# EasyEDA Pro project sjl.epro

# Schematic Schematic1
Board Name: Board1; Create Date: 2025-03-23; Page Name: P1; Project Name: 电赛_2025-03-23_10-41-51; Schematic Name: Schematic1; Update Date: 2025-04-03; Company: 嘉立创EDA; Page Size: A4; Version: V1.0
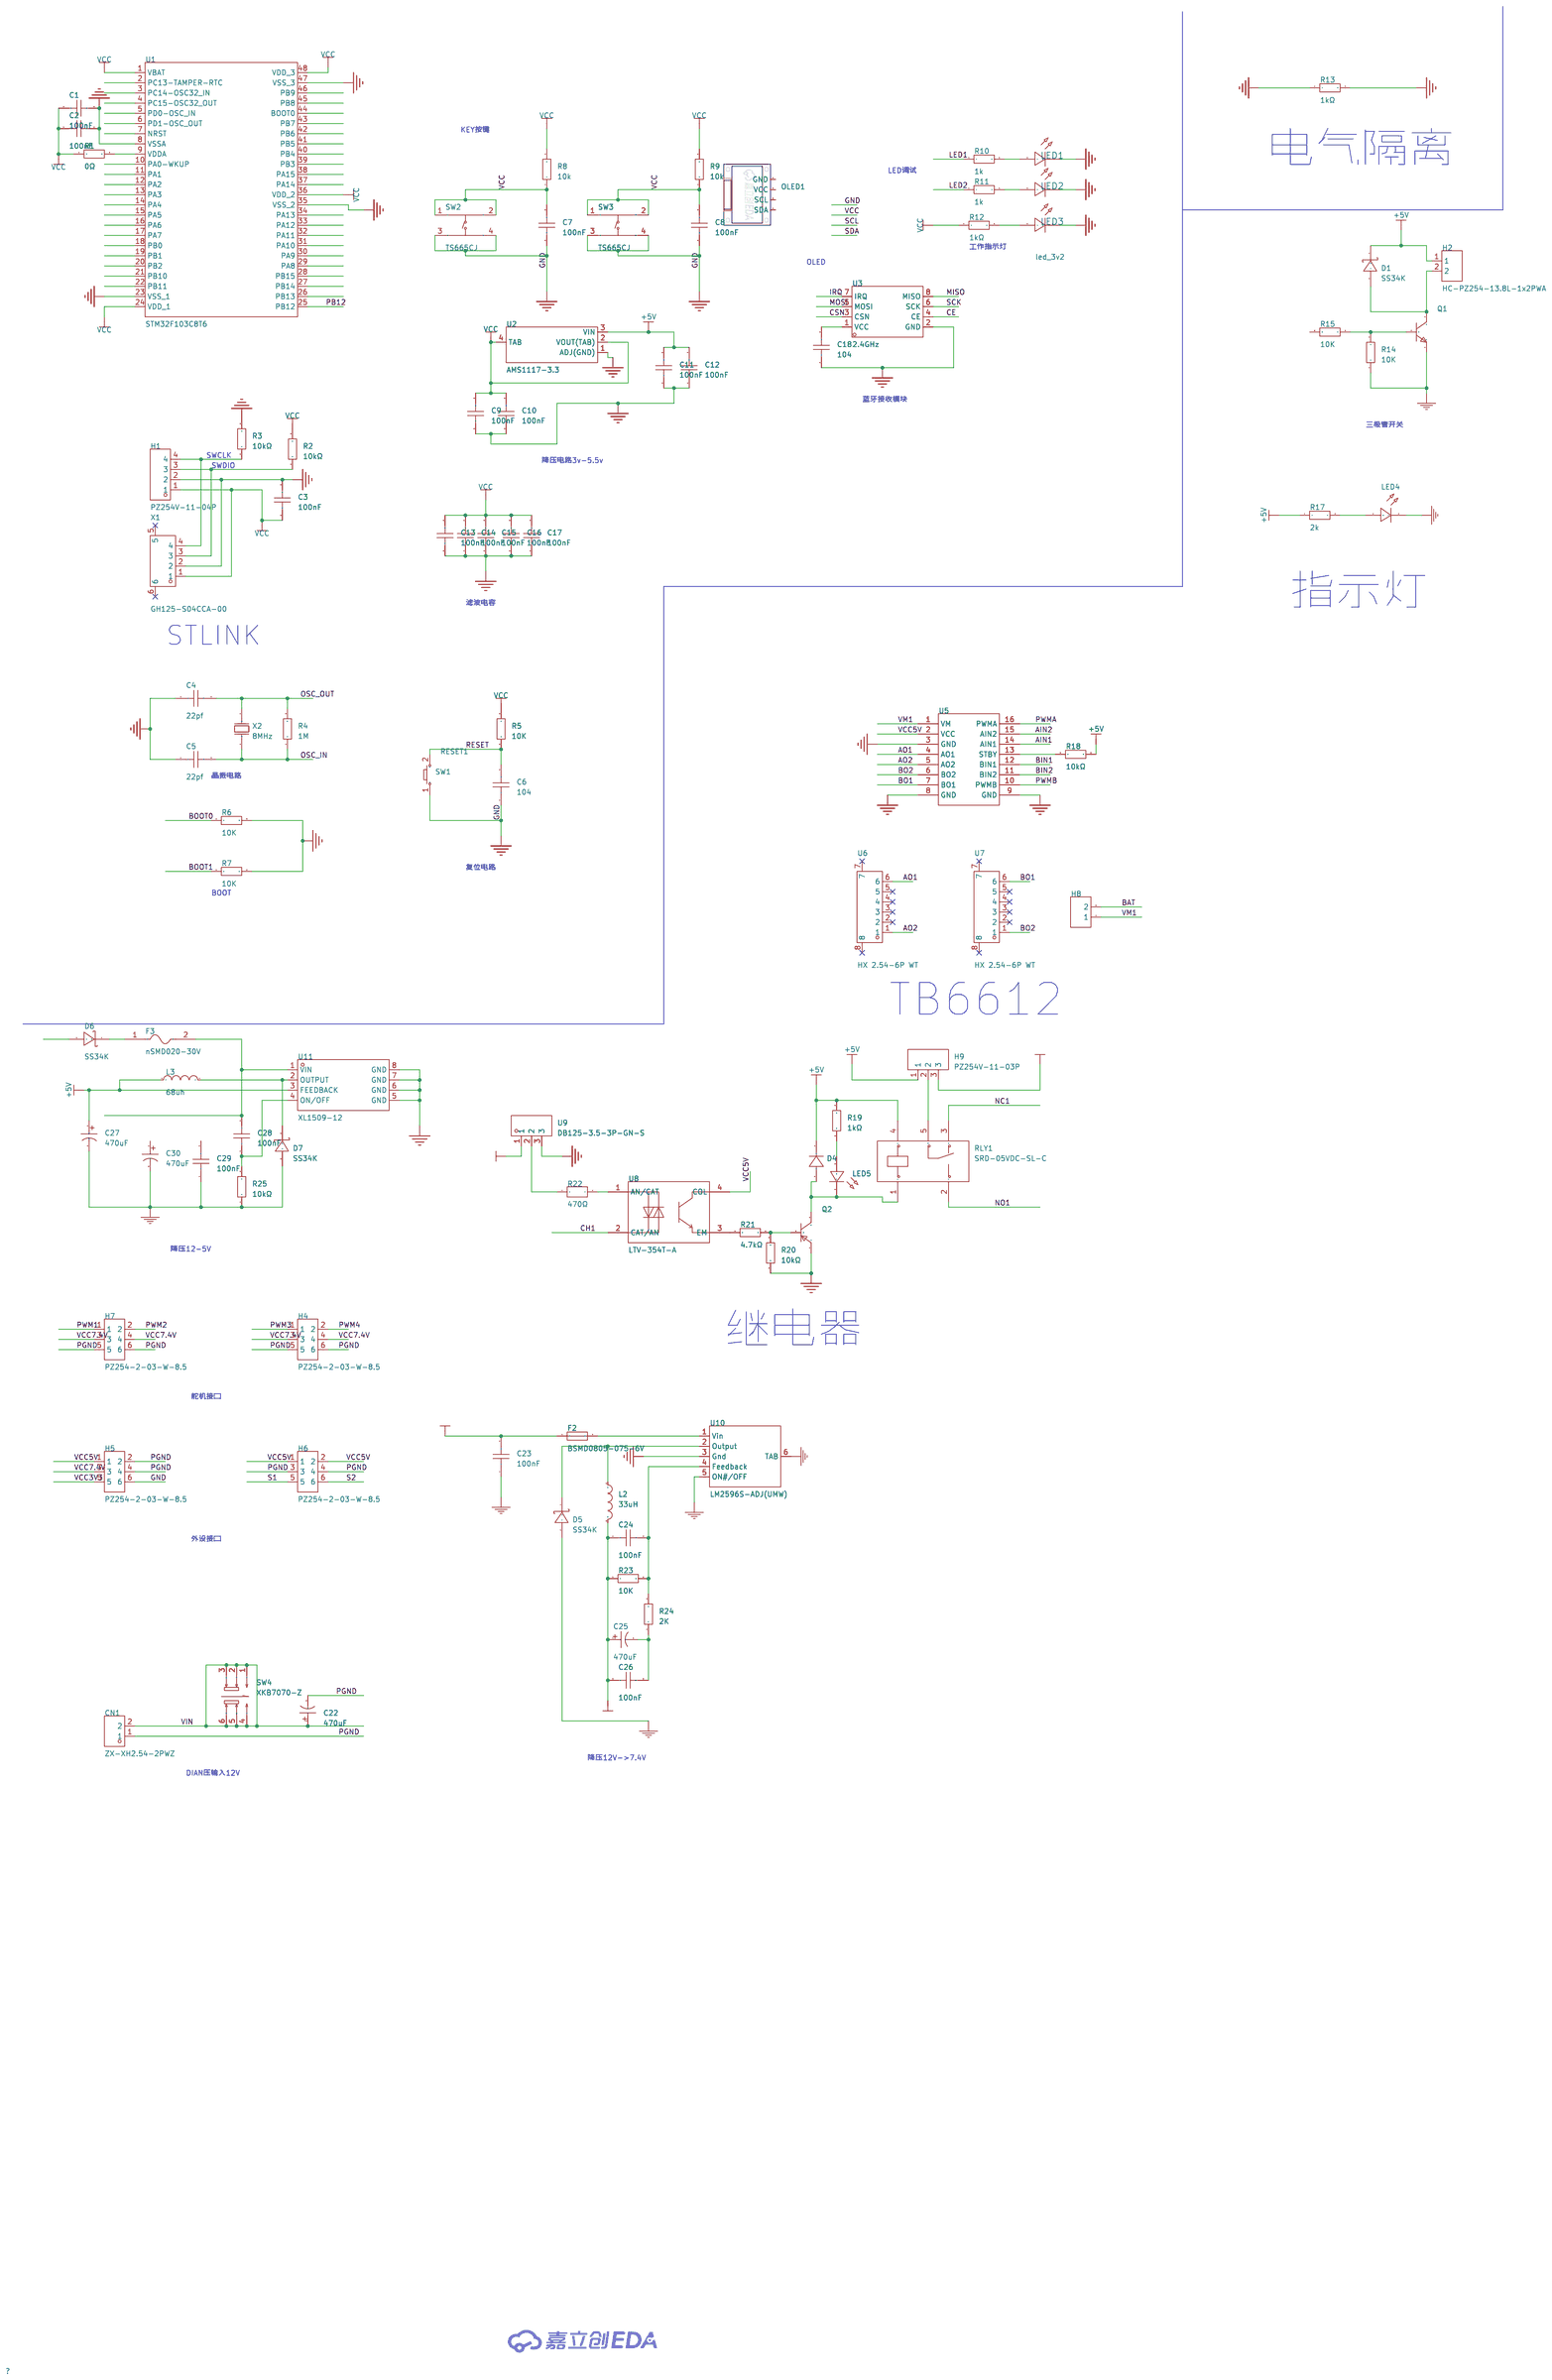
[diagram p0: schematic sheet]

## Parts
C1  100nF  [C0603]
C2  100nF  [C0603]
C3  100nF  [C0603]
C4  22pf  [C0603]
C5  22pf  [C0603]
C6  104  [C0603]
C7  100nF  [C0603]
C8  100nF  [C0603]
C9  100nF  [C0603]
C10  100nF  [C0603]
C11  100nF  [C0603]
C12  100nF  [C0603]
C13  100nF  [C0603]
C14  100nF  [C0603]
C15  100nF  [C0603]
C16  100nF  [C0603]
C17  100nF  [C0603]
C18  104  [C0603]
C22  470uF  [CAP-SMD_BD10.0-L10.3-W10.3-FD]
C23  100nF  [C0603]
C24  100nF  [C0603]
C25  470uF  [CAP-SMD_BD10.0-L10.3-W10.3-FD]
C26  100nF  [C0603]
C27  470uF  [CAP-SMD_BD10.0-L10.3-W10.3-FD]
C28  100nF  [C0603]
C29  100nF  [C0603]
C30  470uF  [CAP-SMD_BD10.0-L10.3-W10.3-FD]
CN1  ZX-XH2.54-2PWZ  [CONN-TH_2P-P2.50_ZX-XH2.54-2PWZ]
D1  SS34K  [SMA_L4.3-W2.6-LS5.2-RD]
D4  -  [DO_1N4007]
D5  SS34K  [SMA_L4.3-W2.6-LS5.2-RD]
D6  SS34K  [SMA_L4.3-W2.6-LS5.2-RD]
D7  SS34K  [SMA_L4.3-W2.6-LS5.2-RD]
F2  BSMD0805-075-6V  [F0805]
F3  nSMD020-30V  [F1206]
H1  PZ254V-11-04P  [HDR-TH_4P-P2.54-V-M]
H2  HC-PZ254-13.8L-1x2PWA  [HDR-TH_2P-P2.54-H-M-W10.0]
H4  PZ254-2-03-W-8.5  [HDR-TH_6P-P2.54-H-M-R2-C3-S2.54-W12.3-N]
H5  PZ254-2-03-W-8.5  [HDR-TH_6P-P2.54-H-M-R2-C3-S2.54-W12.3-N]
H6  PZ254-2-03-W-8.5  [HDR-TH_6P-P2.54-H-M-R2-C3-S2.54-W12.3-N]
H7  PZ254-2-03-W-8.5  [HDR-TH_6P-P2.54-H-M-R2-C3-S2.54-W12.3-N]
H8  -  [HDR-TH_2P-P2.54-V-F]
H9  PZ254V-11-03P  [HDR-TH_3P-P2.54-V-M]
L2  33uH  [L0603]
L3  68uh  [L0603]
LED1  -  [LED_0603]
LED2  -  [LED_0603]
LED3  led_3v2  [LED_0603]
LED4  -  [LED_TH-3mm]
LED5  -  [LED_TH-3mm]
OLED1  -  [0.96OLED_4P]
Q1  -  [S8050_SOT-23]
Q2  -  [S8550P_SOT]
R1  0Ω  [R0603]
R2  10kΩ  [R0603]
R3  10kΩ  [R0603]
R4  1M  [R0603]
R5  10K  [R0603]
R6  10K  [R0603]
R7  10K  [R0603]
R8  10k  [R0603]
R9  10k  [R0603]
R10  1k  [R0603]
R11  1k  [R0603]
R12  1kΩ  [R0603]
R13  1kΩ  [R0603]
R14  10K  [R0603]
R15  10K  [R0603]
R17  2k  [R0603]
R18  10kΩ  [R0603]
R19  1kΩ  [R0603]
R20  10kΩ  [Res_1/8W]
R21  4.7kΩ  [R0603]
R22  470Ω  [R0603]
R23  10K  [R0603]
R24  2K  [R0603]
R25  10kΩ  [Res_1/8W]
RLY1  SRD-05VDC-SL-C  [RELAY-TH_SRD-XXVDC-XL-C]
SW1  RESET1  [Key_SMD_3x4x2]
SW2  TS665CJ  [SW-TH_4P-L6.0-W6.0-P4.50-LS6.5]
SW3  TS665CJ  [SW-TH_4P-L6.0-W6.0-P4.50-LS6.5]
SW4  XKB7070-Z  [SW-TH_6P-L7.0-W7.0-P2.00]
U1  STM32F103C8T6  [LQFP-48_L7.0-W7.0-P0.50-LS9.0-BL]
U2  AMS1117-3.3  [SOT-223-4_L6.5-W3.5-P2.30-LS7.0-BR]
U3  2.4GHz  [WIRELM-TH_NF-01-S]
U5  -
U6  HX 2.54-6P WT  [CONN-SMD_6P-P2.50_HANXIA_HX-2.54-6P-WT]
U7  HX 2.54-6P WT  [CONN-SMD_6P-P2.50_HANXIA_HX-2.54-6P-WT]
U8  LTV-354T-A  [SOP-4_L3.9-W4.4-P2.54-LS7.0-TL]
U9  DB125-3.5-3P-GN-S  [CONN-TH_3P-P3.50_L7.4-W10.5]
U10  LM2596S-ADJ(UMW)  [TO-263-5_L10.2-W8.9-P1.70-BR]
U11  XL1509-12  [SOIC-8_L4.9-W3.9-P1.27-LS6.0-BL]
X1  GH125-S04CCA-00  [CONN-SMD_4P-P1.25_JS_GH125-S04CCA-00]
X2  8MHz  [CRYSTAL-SMD_L5.0-W3.2]

## Library data of the parts
C1-C3 C6-C18 = CGA0603X7R104K500JT: 容值:100nF;精度:±10%;额定电压:50V;温度系数:X7R;; LCSC Part Name: 100nF ±10% 50V; Supplier Part: C6119867; Manufacturer: HRE(芯声); Supplier Footprint: 0603; JLCPCB Part Class: Extended Part; Datasheet: https://atta.szlcsc.com/upload/public/pdf/source/20250103/C44077DA9E7B3EFAE02F22B6D3D1CBC9.pdf; Supplier: LCSC; Tolerance: ±10%; Voltage Rating: 50V; Temperature Coefficient: X7R
C4 C5 C23 C24 C26 C28 C29 = CAP_0603: Supplier Footprint: 0603
C22 C25 C27 C30 = RVT1E471M1010_C72518: 容值:470uF;精度:±20%;额定电压:25V;纹波电流:286mA@120Hz;等效串联电阻(ESR):-;; LCSC Part Name: 470uF ±20% 25V; Supplier Part: C72518; Manufacturer: ROQANG(容强); Manufacturer Part: RVT1E471M1010; Supplier Footprint: SMD,D10xL10.2mm; JLCPCB Part Class: Extended Part; Datasheet: https://atta.szlcsc.com/upload/public/pdf/source/20170325/1490427950282.pdf; Supplier: LCSC; Tolerance: ±20%; Voltage Rating: 25V; Ripple Current: 286mA@120Hz; Diameter: 10mm; Height - Seated (Max): 10.2mm; Lifetime: 2000hrs@105℃; Operating Temperature: -40℃~+105℃
CN1 = ZX-XH2.54-2PWZ: 插针结构:1x2P;间距:2.5mm;安装方式:弯插;参考系列:XH;总PIN数:2P;排数:1;每排PIN数:2;行距:-;额定电流:3A;触头材质:黄铜;触头镀层:锡;工作温度范围:-25℃~+85℃;; LCSC Part Name: 1x2P 间距:2.5mm 弯插 系列:XH; Supplier Part: C7429641; Manufacturer: Megastar(兆星); Supplier Footprint: 弯插,P=2.5mm; JLCPCB Part Class: Extended Part; Datasheet: https://atta.szlcsc.com/upload/public/pdf/source/20230619/56AE8F2E01CDFEAA97FC89B5ED558AB5.pdf; Supplier: LCSC; Pins Structure: 1x2P; Pitch: 2.5mm; Mounting Type: 弯插; Reference Series: XH; Number of Pins: 2P; Number of Rows: 1; Number of PINs Per Row: 2; Rated Current: 3A; Contact Material: 黄铜; Contact Plating: 锡; Operating Temperature: -25℃~+85℃; Rated Voltage (Max): 250V; Plastic Material: PA66; Flame Retardant Rating: UL94V-0; Color: 白色; Z-Height of the Board: 5.9mm; X-Length of Bottom Edge on Board (Spacing Line): 7.5mm; Y-Width of Bottom Edge on Board: 7.32mm
D1 D5-D7 = SS34K: 二极管配置:独立式;直流反向耐压(Vr):40V;平均整流电流(Io):3A;正向压降(Vf):550mV@3A;反向电流(Ir):500uA@40V;; LCSC Part Name: 40V 3A 550mV@3A; Supplier Part: C2944425; Manufacturer: TDD(台冠电子); Supplier Footprint: SMA; JLCPCB Part Class: 扩展库; Datasheet: https://atta.szlcsc.com/upload/public/pdf/source/20220223/24F7DC9B6926A710C4F4F20869BDEBCF.pdf; Supplier: LCSC; Diode Configuration: 独立式; Reverse Voltage (Vr): 40V; Average Rectified Current (Io): 3A; Forward Voltage (Vf@If): 550mV@3A; Reverse Leakage Current (Ir): 500uA@40V
D4 = D_1N4007A: Supplier Footprint: DO-41
F2 = BSMD0805-075-6V: 最大电压:6V;最大电流:40A;保持电流:750mA;跳闸电流:1.5A;; LCSC Part Name: 6V 750mA 0805自恢复; Supplier Part: C883110; Manufacturer: BHFUSE(佰宏); Supplier Footprint: 0805; JLCPCB Part Class: Extended Part; Datasheet: https://atta.szlcsc.com/upload/public/pdf/source/20220223/3FD8E8A8A3681642EAEF465E16495357.pdf; Supplier: LCSC; Operating Voltage (Max): 6V; Current Rating (Max): 40A; Hold Current: 750mA; Trip Current: 1.5A; Power Dissipation: 600mW; Resistance - Initial (Ri) (Min): 70mΩ; Resistance - Post Trip (R1) (Max): 385mΩ; Maximum Time to Trip: 200ms; Operating Temperature: -40℃~+85℃
F3 = nSMD020-30V: 耐压:30V;最大电流:100A;保持电流(Ih):200mA;跳闸电流:460mA;; LCSC Part Name: 30V 200mA 1206自恢复; Supplier Part: C69680; Manufacturer: 台湾陆海; Supplier Footprint: 1206; JLCPCB Part Class: Extended Part; Datasheet: https://atta.szlcsc.com/upload/public/pdf/source/20230404/9F5B471D89C649BCC2835D46521A6324.pdf; Supplier: LCSC; Voltage - Max: 30V; Current - Max: 100A; Hold Current: 200mA; Trip Current: 460mA
H1 = PZ254V-11-04P: 插针结构:1x4P;间距:2.54mm;行距:-;圆针/方针:方针;安装类型:直插;排数:单排;总PIN位数:4P;额定电流:3A;额定电压:250V;配合针长度:6mm;塑高:2.5mm;端接针长度:3mm;触头材质:-;工作温度范围:-40℃~+105℃;颜色:黑色;; LCSC Part Name: 间距:2.54mm 1x4P 直插 方针; Supplier Part: C2691448; Manufacturer: XFCN(兴飞); Supplier Footprint: 插件,P=2.54mm; JLCPCB Part Class: Extended Part; Datasheet: https://atta.szlcsc.com/upload/public/pdf/source/20200309/C492403_F9F19131791D08044AD4F84F8E751A34.pdf; Supplier: LCSC; Pin Structure: 1x4P; Pitch: 2.54mm; Circluar Pins/Square Pins: 方针; Mounting Type: 直插; Number of Rows: 单排; Number of Pins: 4P; Current Rating (Max): 3A; Voltage Rating (Max): 250V; Length of Mating Pin: 6mm; Insulation Height: 2.5mm; Length of End Connection Pin: 3mm; Operating Temperature Range: -40℃~+105℃; Color: 黑色
H2 = HC-PZ254-13.8L-1x2PWA: 插针结构:1x2P;间距:2.54mm;行距:-;圆针/方针:方针;安装方式:弯插;排数:单排;总PIN位数:2P;额定电流:3A;额定电压:-;配合针长度:6mm;塑高:2.5mm;端接针长度:3mm;触头材质:黄铜;触头镀层:金;工作温度:-40℃~+105℃;颜色:黑色;; LCSC Part Name: 1x2P 间距:2.54mm 方针 弯插; Supplier Part: C27985201; Manufacturer: HC(虹成电子); Supplier Footprint: 弯插,P=2.54mm; JLCPCB Part Class: Extended Part; Datasheet: https://atta.szlcsc.com/upload/public/pdf/source/20250106/2CC12058963FF98249E2E6FA65E04B96.pdf; Supplier: LCSC; Pin Structure: 1x2P; Pitch: 2.54mm; Circluar Pins/Square Pins: 方针; Mounting Type: 弯插; Number of Rows: 单排; Number of Pins: 2P; Current Rating: 3A; Length of Mating Pin: 6mm; Insulation Height: 2.5mm; Length of End Connection Pin: 3mm; Contact Material: 黄铜; Contact Plating: 金; Operating Temperature: -40℃~+105℃; Color: 黑色
H4-H7 = PZ254-2-03-W-8.5: 插针结构:2x3P;间距:2.54mm;行距:2.54mm;圆针/方针:方针;安装方式:弯插;排数:双排;总PIN位数:6P;额定电流:3A;额定电压:-;配合针长度:6mm;塑高:2.5mm;端接针长度:-;触头材质:-;工作温度:-40℃~+105℃;颜色:黑色;; LCSC Part Name: 2x3P 间距:2.54mm 方针 弯插; Supplier Part: C2894983; Manufacturer: HCTL(华灿天禄); Supplier Footprint: 弯插,P=2.54mm; JLCPCB Part Class: Extended Part; Datasheet: https://atta.szlcsc.com/upload/public/pdf/source/20230609/1B60364E488FD8696AA7206A46578DEA.pdf; Supplier: LCSC; Pin Structure: 2x3P; Pitch: 2.54mm; Row Spacing: 2.54mm; Circluar Pins/Square Pins: 方针; Mounting Type: 弯插; Number of Rows: 双排; Number of Pins: 6P; Current Rating: 3A; Length of Mating Pin: 6mm; Insulation Height: 2.5mm; Operating Temperature: -40℃~+105℃; Color: 黑色
H8 = HDR-F_2.54_1x2P: Supplier Part: C49661; Supplier Footprint: 插件
H9 = PZ254V-11-03P: 插针结构:1x3P;间距:2.54mm;行距:-;圆针/方针:方针;安装方式:直插;排数:单排;总PIN位数:3P;额定电流:3A;额定电压:250V;配合针长度:6mm;塑高:2.5mm;端接针长度:3mm;工作温度:-40℃~+105℃;颜色:黑色;; LCSC Part Name: 1x3P 间距:2.54mm 方针 直插; Supplier Part: C2937625; Manufacturer: XFCN(兴飞); Supplier Footprint: 插件,P=2.54mm; JLCPCB Part Class: Extended Part; Datasheet: https://atta.szlcsc.com/upload/public/pdf/source/20200309/C492402_8335C3D49C4E4C618838D59BB1D024C1.pdf; Supplier: LCSC; Pin Structure: 1x3P; Pitch: 2.54mm; Circluar Pins/Square Pins: 方针; Mounting Type: 直插; Number of Rows: 单排; Number of Pins: 3P; Current Rating: 3A; Voltage Rating (Max): 250V; Length of Mating Pin: 6mm; Insulation Height: 2.5mm; Length of End Connection Pin: 3mm; Operating Temperature: -40℃~+105℃; Color: 黑色
L2 L3 = L_0603
LED1-LED3 = LED_0603-R: Supplier Footprint: 0603
LED4 LED5 = LED_TH-R_3mm: Supplier Footprint: 插件
OLED1 = 0.96OLED模块_4P: Supplier Footprint: 插件
Q1 = S8050_SOT_NPN: Supplier Footprint: SOT-23
Q2 = S8550_SOT_PNP: Supplier Footprint: SOT-23
R1 R4 R5 R8-R11 = 0603WAF0000T5E: 电阻类型:厚膜电阻;阻值:0Ω;精度:±1%;功率:100mW;最大工作电压:75V;; LCSC Part Name: 0Ω ±1% 100mW 厚膜电阻; Supplier Part: C21189; Manufacturer: UNI-ROYAL(厚声); Supplier Footprint: 0603; JLCPCB Part Class: Basic Part; Datasheet: https://atta.szlcsc.com/upload/public/pdf/source/20200306/C422600_1E6D84923E4A46A82E41ADD87F860B5C.pdf; Supplier: LCSC; Type: 厚膜电阻; Tolerance: ±1%; Power(Watts): 100mW; Overload Voltage (Max): 75V; Operating Temperature Range: -55℃~+155℃
R2 R3 R18 = 0603WAF1002T5E: 电阻类型:厚膜电阻;阻值:10kΩ;精度:±1%;功率:100mW;最大工作电压:75V;温度系数:±100ppm/℃;; LCSC Part Name: 厚膜电阻 10kΩ ±1% 100mW; Supplier Part: C25804; Manufacturer: UNI-ROYAL(厚声); Supplier Footprint: 0603; JLCPCB Part Class: Basic Part; Datasheet: https://atta.szlcsc.com/upload/public/pdf/source/20200306/C422600_1E6D84923E4A46A82E41ADD87F860B5C.pdf; Supplier: LCSC; Type: 厚膜电阻; Tolerance: ±1%; Power(Watts): 100mW; Overload Voltage (Max): 75V; Temperature Coefficient: ±100ppm/℃; Operating Temperature Range: -55℃~+155℃
R6 R7 R14 R15 R17 R23 = Res_0603: Supplier Footprint: 0603
R12 R13 R19 = 0603WAF1001T5E: 电阻类型:厚膜电阻;阻值:1kΩ;精度:±1%;功率:100mW;最大工作电压:75V;温度系数:±100ppm/℃;; LCSC Part Name: 1kΩ ±1% 100mW 厚膜电阻; Supplier Part: C21190; Manufacturer: UNI-ROYAL(厚声); Supplier Footprint: 0603; JLCPCB Part Class: Basic Part; Datasheet: https://atta.szlcsc.com/upload/public/pdf/source/20200306/C422600_1E6D84923E4A46A82E41ADD87F860B5C.pdf; Supplier: LCSC; Type: 厚膜电阻; Tolerance: ±1%; Power(Watts): 100mW; Overload Voltage (Max): 75V; Temperature Coefficient: ±100ppm/℃; Operating Temperature Range: -55℃~+155℃
R20 R25 = Res_AXIAL-1/8W: Supplier Footprint: 轴向引线
R21 R24 = 0603WAF4701T5E: 电阻类型:厚膜电阻;阻值:4.7kΩ;精度:±1%;功率:100mW;最大工作电压:75V;温度系数:±100ppm/℃;; LCSC Part Name: 4.7kΩ ±1% 100mW 厚膜电阻; Supplier Part: C23162; Manufacturer: UNI-ROYAL(厚声); Supplier Footprint: 0603; JLCPCB Part Class: Basic Part; Datasheet: https://atta.szlcsc.com/upload/public/pdf/source/20200306/C422600_1E6D84923E4A46A82E41ADD87F860B5C.pdf; Supplier: LCSC; Type: 厚膜电阻; Tolerance: ±1%; Power(Watts): 100mW; Overload Voltage (Max): 75V; Temperature Coefficient: ±100ppm/℃; Operating Temperature Range: -55℃~+155℃
R22 = CR164700F: 电阻类型:厚膜电阻;阻值:470Ω;精度:±1%;功率:100mW;温度系数:±100ppm/℃;; LCSC Part Name: 厚膜电阻 470Ω ±1% 100mW; Supplier Part: C4045076; Manufacturer: Meritek; Supplier Footprint: 0603; JLCPCB Part Class: Extended Part; Datasheet: https://atta.szlcsc.com/upload/public/pdf/source/20240408/EFC32A6E0B04D07E4D8A435A440C47B4.pdf; Supplier: LCSC; Type: 厚膜电阻; Tolerance: ±1%; Power(Watts): 100mW; Temperature Coefficient: ±100ppm/℃; Operating Temperature: -55℃~+155℃
RLY1 = SRD-05VDC-SL-C: 线圈电压:5V;触点形式:一组转换:1C(单刀双掷-转换);触点容量(电阻负载):-;最大切换电压:250V@AC;最大切换电流:15A;; LCSC Part Name: 蓝色; Supplier Part: C35449; Manufacturer: 松乐; Supplier Footprint: 插件,15.6x19.2mm; JLCPCB Part Class: Extended Part; Datasheet: https://atta.szlcsc.com/upload/public/pdf/source/20200305/C490149_C96E4098A3B1FFB377D5AD2E40B7C2A8.pdf; Supplier: LCSC; Coil Voltage: 5V; Contact Form: 一组转换:1C(单刀双掷-转换); Pin Number: 5; Maximum Switching Voltage: 250V@AC; Coil Rated Power: 360mW; Maximum Switching Current: 15A; Coil Type: 无极性-单线圈; Coil Resistance: 70Ω; Contact Resistance: 100mΩ; Operate Time: 10ms; Release Time: 10ms
SW1 = Key_SMD_3x4x2: Supplier Footprint: SMD
SW2 SW3 = TS665CJ: 电路结构:单刀单掷;按钮形状:圆形按钮;安装方式:直插;开关长度:6mm;开关宽度:6mm;开关高度:5mm;触点电流:50mA;额定电压(DC):12V;带灯:-;机械寿命:-;; LCSC Part Name: 6*6*5mm 直插 轻触开关; Supplier Part: C393938; Manufacturer: SHOU HAN(首韩); Supplier Footprint: 插件; JLCPCB Part Class: Extended Part; Datasheet: https://atta.szlcsc.com/upload/public/pdf/source/20190521/C393938_BDABEAC600B4C55E200A80AA129B70BC.pdf; Supplier: LCSC; Circuit: 单刀单掷; Actuator Style: 圆形按钮; Mounting Style: 直插; Switch Length: 6mm; Switch Width: 6mm; Switch Height: 5mm; Contact Current: 50mA; Voltage Rating (DC): 12V
SW4 = XKB7070-Z: 自锁/无锁:自锁;安装方式:直插;触点电流:100mA;额定电压 (AC):250V;额定电压 (DC):30V;带灯:不带;作用力:160gf;机械寿命:10万次;; LCSC Part Name: 按键开关   7*7插件自锁 蓝白黑; Supplier Part: C318863; Manufacturer: XKB Connectivity(中国星坤); Supplier Footprint: 插件; JLCPCB Part Class: Extended Part; Datasheet: https://atta.szlcsc.com/upload/public/pdf/source/20211015/75A682A27A424BDE8D93C2CFA14C38FE.pdf; Supplier: LCSC; Self Lock / No Lock: 自锁; Actuator Style: 矩形按钮; Mounting Style: 直插; Contact Current: 100mA; Voltage Rating (AC): 250V; Voltage Rating (DC): 30V; Insulation Resistance: 100MΩ; Actuator/Cap Color: 蓝色; With Lamp: 不带; Pin Style: PC引脚; Operating Force: 160gf; Operating Temperature: -15℃~+55℃; Mechanical Life: 10万次
U1 = STM32F103C8T6: CPU内核:ARM-M3;CPU最大主频:72MHz;应用领域:-;; LCSC Part Name: 主流增强型ARM Cortex-M3 MCU，具有64 KB Flash、72 MHz CPU、电机控制、USB和CAN; Supplier Part: C8734; Manufacturer: ST(意法半导体); Supplier Footprint: LQFP-48(7x7); JLCPCB Part Class: Extended Part; Datasheet: https://atta.szlcsc.com/upload/public/pdf/source/20220812/8363ACEC51AD55ECEB84799464F7CB85.pdf; Supplier: LCSC; CPU Core: ARM-M3; CPU Maximum Speed: 72MHz; Program Storage Size: 64KB; Program Memory Type: FLASH; Number of I/O: 37; ADC (Bit): 12bit; Low Voltage Detection Threshold: 2V~3.6V
U2 = AMS1117-3.3_C347222: 输出类型:固定;工作电压:12V;输出电压:3.3V;输出电流:1A;电源纹波抑制比(PSRR):60dB@(120Hz);输出极性:正极;; LCSC Part Name: 输出:3.3V 电流:1A 耐压:12V; Supplier Part: C347222; Manufacturer: UMW(友台半导体); Supplier Footprint: SOT-223; JLCPCB Part Class: Extended Part; Datasheet: https://atta.szlcsc.com/upload/public/pdf/source/20241218/BAF0263FA2E44BCD8AF41AA4FA04EFAA.pdf; Supplier: LCSC; Output Type: 固定; Voltage - Supply: 12V; Output Voltage: 3.3V; Output Current: 1A; Power Supply Rejection Ratio (PSRR): 60dB@(120Hz); Voltage Dropout: 1.3V@(1A); Features: 过流保护; Output Configuration: 正极; Number of Outputs: 1
U3 = NF-01-S: 模式:发射;频率:2.4GHz;天线形式:板载PCB天线;接收灵敏度:-96dBm;; LCSC Part Name: 2.4G无线模块，新版的NF-01-S; Supplier Part: C135576; Manufacturer: Ai-Thinker(安信可); Supplier Footprint: DIP-8; JLCPCB Part Class: Extended Part; Datasheet: https://atta.szlcsc.com/upload/public/pdf/source/20180404/C135576_0550A89EE6EE32369D734FB4B4EB7736.pdf; Supplier: LCSC; Model: 发射; Modulation System: FSK；GFSK; Output Power  (Max): 7dBm; Support Interface: SPI; Operating Voltage: 1.9V~3.6V; Antenna Type: 板载PCB天线; Receive  Current: 15mA; Send  Current: 25mA; Sensitivity: -96dBm; Operating Temperature: -20℃~+85℃
U5 = TB6612: 电机驱动
U6 U7 = HX 2.54-6P WT: 插针结构:1x6P;间距:2.54mm;安装方式:卧贴;总PIN数:6P;排数:1;每排PIN数:6;额定电流:3A;工作温度范围:-25℃~+85℃;; LCSC Part Name: 1x6P 间距:2.54mm 卧贴; Supplier Part: C5142102; Manufacturer: hanxia(韩下); Supplier Footprint: SMD,P=2.5mm; JLCPCB Part Class: Extended Part; Datasheet: https://atta.szlcsc.com/upload/public/pdf/source/20220818/14D0F2FC4AE001CBBB1780D768A02216.pdf; Supplier: LCSC; Pins Structure: 1x6P; Pitch: 2.54mm; Mounting Style: 卧贴; Number of Pins: 6P; Number of Rows: 1; Number of PINs Per Row: 6; Current Rating (Max): 3A; Operating Temperature Range: -25℃~+85℃
U8 = LTV-354T-A: 输入电压类型:AC,DC;正向电压:1.2V;输出电流:50mA;隔离电压(rms):3.75kV;反向电压:-;接收端电压:35V;输出通道数:1;集射极饱和电压(Vce(sat)@Ic,IF):100mV@1mA,20mA;; LCSC Part Name: AC,DC输入 隔离电压(rms):3750V; Supplier Part: C10802; Manufacturer: LITEON(光宝); Supplier Footprint: SOP-4-2.54mm; JLCPCB Part Class: Extended Part; Datasheet: https://atta.szlcsc.com/upload/public/pdf/source/20170807/C119090_1502077835934868429.pdf; Supplier: LCSC; Input voltage type: AC,DC; Output Type: 光电三极管; Forward Voltage: 1.2V; Output Current: 50mA; Isolation Voltage(rms): 3.75kV; Receiving End Voltage: 35V; Number of Outputs: 1; Collector-Emitter Saturation Voltage (Vce(sat)@Ic,IF): 100mV@1mA,20mA; Rise time: 4us@2mA,100Ω; Fall time: 3us@2mA,100Ω; Operating Temperature: -55℃~+100℃
U9 = DB125-3.5-3P-GN-S: 结构:1x3P;间距:3.5mm;颜色:绿色;安装方式:直插;额定电流:13.5A;额定电压:250V;排数:1;线规 - AWG:16~28;线规 - 平方毫米:1;每排PIN数:3;工作温度范围:-40℃~+105℃;; LCSC Part Name: 3.5mm 1x3P 排数:1 每排P数:3 直插; Supplier Part: C466971; Manufacturer: DORABO(地博电气); Supplier Footprint: 插件,P=3.5mm; JLCPCB Part Class: Extended Part; Datasheet: https://atta.szlcsc.com/upload/public/pdf/source/20221227/3B943AA1CFCAE24F1BA4E72404938A89.pdf; Supplier: LCSC; Structure: 1x3P; Pitch: 3.5mm; Color: 绿色; Mounting Style: 直插; Current Rating (Max): 13.5A; Voltage Rating (Max): 250V; Number of Pins: 3P; Number of Rows: 1; Wire Gauge - AWG: 16~28; Wire Gauge - mm2: 1; Number of PINs Per Row: 3; Operating Temperature Range: -40℃~+105℃
U10 = LM2596S-ADJ(UMW): 功能类型:降压型;输出类型:可调;工作电压:40V;输出电压:1.2V~37V;输出电流:3A;; LCSC Part Name: 3A降压稳压器; Supplier Part: C347423; Manufacturer: UMW(友台半导体); Supplier Footprint: TO-263-5; JLCPCB Part Class: Extended Part; Datasheet: https://atta.szlcsc.com/upload/public/pdf/source/20241113/7515F50B4FEE0270D4DE7078364C87FA.pdf; Supplier: LCSC; Function: 降压型; Output Type: 可调; Input Voltage: 40V; Output Voltage: 1.2V~37V; Output Current: 3A; Switching Frequency: 150kHz; Operating Temperature: -40℃~+125℃@(TA); Synchronous Rectification: 否; Number of Outputs: 1; Topology: 降压式; Quiescent Current (Iq): 80uA; Switch tube (built-in/external): 内置
U11 = XL1509-12: 功能类型:降压型;输出类型:固定;工作电压:4.5V~40V;输出电压:12V;输出电流:2A;; LCSC Part Name: 150 KHz 固定频率 PWM 降压 DC/DC 转换器; Supplier Part: C2889160; Manufacturer: UMW(友台半导体); Supplier Footprint: SOP-8; JLCPCB Part Class: Extended Part; Datasheet: https://atta.szlcsc.com/upload/public/pdf/source/20241113/D9907419AB21EE12D855D7DFAFDDCB19.pdf; Supplier: LCSC; Function: 降压型; Output Type: 固定; Input Voltage: 4.5V~40V; Output Voltage: 12V; Output Current: 2A; Switching Frequency: 150kHz; Operating Temperature: -40℃~+125℃; Synchronous Rectification: 否; Number of Outputs: 1; Topology: 降压式; Quiescent Current (Iq): 150uA; Switch tube (built-in/external): 内置
X1 = GH125-S04CCA-00: 插针结构:1x4P;间距:1.25mm;安装方式:立贴;参考系列:-;总PIN数:4P;排数:1;每排PIN数:4;行距:-;额定电流:1A;工作温度范围:-25℃~+85℃;; LCSC Part Name: 1x4P 间距:1.25mm 立贴; Supplier Part: C2886782; Manufacturer: JS(钜硕电子); Supplier Footprint: SMD,P=1.25mm; JLCPCB Part Class: Extended Part; Datasheet: https://atta.szlcsc.com/upload/public/pdf/source/20210818/35C7AE18760A04DD9417CB3CEC0962A3.pdf; Supplier: LCSC; Pins Structure: 1x4P; Pitch: 1.25mm; Mounting Style: 立贴; Number of Pins: 4P; Number of Rows: 1; Number of PINs Per Row: 4; Current Rating (Max): 1A; Operating Temperature Range: -25℃~+85℃
X2 = X50328MSB2GI: 晶振类型:贴片晶振;频率:8MHz;常温频差:±10ppm;负载电容:20pF;频率稳定度:±20ppm;; LCSC Part Name: 8MHz ±10ppm 20pF; Supplier Part: C115962; Manufacturer: YXC(扬兴晶振); Supplier Footprint: SMD5032; JLCPCB Part Class: Basic Part; Datasheet: https://atta.szlcsc.com/upload/public/pdf/source/20240329/44922B0AF7B60E58E9B66993B6077277.pdf; Supplier: LCSC; Type: 贴片晶振; Normal temperature Frequency Tolerance: ±10ppm; Load Capacitance: 20pF; Frequency Stability: ±20ppm; Operating Temperature: -40℃~+85℃

## Nets
+5V: C11.2 C12.2 C27.1 D1.1(C) D4.1(K) H2.1 H9.1 L3.1 R17.1 R18.2 R19.2 RLY1.4 U2.3(VIN) U11.3(FEEDBACK)
GND: C1.2 C2.2 C3.1 C4.1 C5.1 C6.1 C7.1 C8.1 C9.1 C10.1 C11.1 C12.1 C13.1 C14.1 C15.1 C16.1 C17.1 C18.1 H1.2 H5.6 LED1.1(C) LED2.1(C) LED3.1(C) R3.2 R6.2 R7.2 R13.1 R13.2 SW1.1 SW2.3(C) SW2.4(D) SW3.3(C) SW3.4(D) U1.8(VSSA) U1.23(VSS_1) U1.35(VSS_2) U1.47(VSS_3) U2.1(ADJ(GND)) U3.2(GND) U5.3(GND) U5.8(GND) U5.9(GND) U9.3 U10.3(Gnd) U11.5(GND) U11.6(GND) U11.7(GND) U11.8(GND) X1.2
PGND: C22.2 C23.1 C27.2 C29.1 C30.2 CN1.1 D5.2(A) D7.2(A) H4.5 H4.6 H5.2 H5.4 H6.3 H6.4 H7.5 H7.6 LED4.2(A) Q1.2 Q2.2(E) R14.1 R20.1 R25.1 U10.5(ON#/OFF) U10.6(TAB)
VCC: C1.1 C2.1 C3.2 C7.2 C8.2 C9.2 C10.2 C13.2 C14.2 C15.2 C16.2 C17.2 H1.1 R1.1 R2.2 R5.1 R8.1 R8.2 R9.1 R9.2 R12.1 SW2.1(A) SW2.2(B) SW3.1(A) SW3.2(B) U1.1(VBAT) U1.24(VDD_1) U1.36(VDD_2) U1.48(VDD_3) U2.2(VOUT(TAB)) U2.4(TAB) X1.1
VCC3V3: H5.5
VCC5V: H5.1 H6.1 H6.2 U5.2(VCC) U8.4(COL)
VCC7.4V: C24.1 C25.1 C26.1 H4.3 H4.4 H5.3 H7.3 H7.4 L2.2 R23.1
VCCC3V3: U9.1
VIN: C22.1 CN1.2 SW4.1 SW4.2 SW4.3 SW4.4 SW4.5 SW4.6
AIN1: U5.14(AIN1)
AIN2: U5.15(AIN2)
AO1: U5.4(AO1) U6.6
AO2: U5.5(AO2) U6.1
BAT: C23.2 F2.1 H8.2 H9.3
BIN1: U5.12(BIN1)
BIN2: U5.11(BIN2)
BO1: U5.7(BO1) U7.6
BO2: U5.6(BO2) U7.1
BOOT0: R6.1
BOOT1: R7.1
CE: U3.4(CE)
CH1: U8.2(CAT/AN)
CSN: U3.3(CSN)
IRQ: U3.7(IRQ)
LED1: R10.1
LED2: R11.1
MISO: U3.8(MISO)
MOSI: U3.5(MOSI)
NC1: RLY1.3
NO1: RLY1.2
OSC_IN: C5.2 R4.1 X2.2(OSC2)
OSC_OUT: C4.2 R4.2 X2.1(OSC1)
PB12: U1.25(PB12)
PWM1: H7.1
PWM2: H7.2
PWM3: H4.1
PWM4: H4.2
PWMA: U5.16(PWMA)
PWMB: U5.10(PWMB)
RESET: C6.2 R5.2 SW1.2
S1: H6.5
S2: H6.6
SCK: U3.6(SCK)
VM1: H8.1 U5.1(VM)
Net-(C18-2): C18.2 U3.1(VCC)
Net-(C24-2): C24.2 R23.2 R24.2 U10.4(Feedback)
Net-(C25-2): C25.2 C26.2 R24.1
Net-(C28-1): C28.1 R25.2 U11.4(ON/OFF)
Net-(C28-2): C28.2 F3.2 U11.1(VIN)
Net-(D1-2): D1.2(A) H2.2 Q1.3
Net-(D4-2): D4.2(A) LED5.2(A) Q2.3(C) RLY1.1
Net-(D5-1): D5.1(C) L2.1 U10.2(Output)
Net-(D6-1): D6.1(C) F3.1
Net-(D7-1): D7.1(C) L3.2 U11.2(OUTPUT)
Net-(F2-2): F2.2 U10.1(Vin)
Net-(H1-3): H1.3 R2.1 X1.3
Net-(H1-4): H1.4 R3.1 X1.4
Net-(H9-2): H9.2 RLY1.5
Net-(LED1-2): LED1.2(A) R10.2
Net-(LED2-2): LED2.2(A) R11.2
Net-(LED3-2): LED3.2(A) R12.2
Net-(LED4-1): LED4.1(C) R17.2
Net-(LED5-1): LED5.1(C) R19.1
Net-(Q1-1): Q1.1 R14.2 R15.1
Net-(Q2-1): Q2.1(B) R20.2 R21.2
Net-(R1-2): R1.2 U1.9(VDDA)
Net-(R18-1): R18.1 U5.13(STBY)
Net-(R21-1): R21.1 U8.3(EM)
Net-(R22-1): R22.1 U9.2
Net-(R22-2): R22.2 U8.1(AN/CAT)

Not connected (* = marked no-connect by the designer): C29 2; C30 1; D6 2(A); OLED1 1(GND) 2(VCC) 3(SCL) 4(SDA); R15 2; U1 2(PC13-TAMPER-RTC) 3(PC14-OSC32_IN) 4(PC15-OSC32_OUT) 5(PD0-OSC_IN) 6(PD1-OSC_OUT) 7(NRST) 10(PA0-WKUP) 11(PA1) 12(PA2) 13(PA3) 14(PA4) 15(PA5) 16(PA6) 17(PA7) 18(PB0) 19(PB1) 20(PB2) 21(PB10) 22(PB11) 26(PB13) 27(PB14) 28(PB15) 29(PA8) 30(PA9) 31(PA10) 32(PA11) 33(PA12) 34(PA13) 37(PA14) 38(PA15) 39(PB3) 40(PB4) 41(PB5) 42(PB6) 43(PB7) 44(BOOT0) 45(PB8) 46(PB9); U6 2* 3* 4* 5* 7* 8*; U7 2* 3* 4* 5* 7* 8*; X1 5* 6*

## Notes on the sheet
- KEY按键
- LED调试
- 电气隔离
- 工作指示灯
- OLED
- 蓝牙接收模块
- 三极管开关
- SWCLK
- 降压电路3v-5.5v
- SWDIO
- 滤波电容
- 指示灯
- STLINK
- 晶振电路
- 复位电路
- BOOT
- TB6612
- 降压12-5V
- 继电器
- 舵机接口
- 外设接口
- 降压12V->7.4V
- DIAN压输入12V
